# EAGLE design digital lockin (EAGLE 9.6.2)

## Sheet 1 of 2
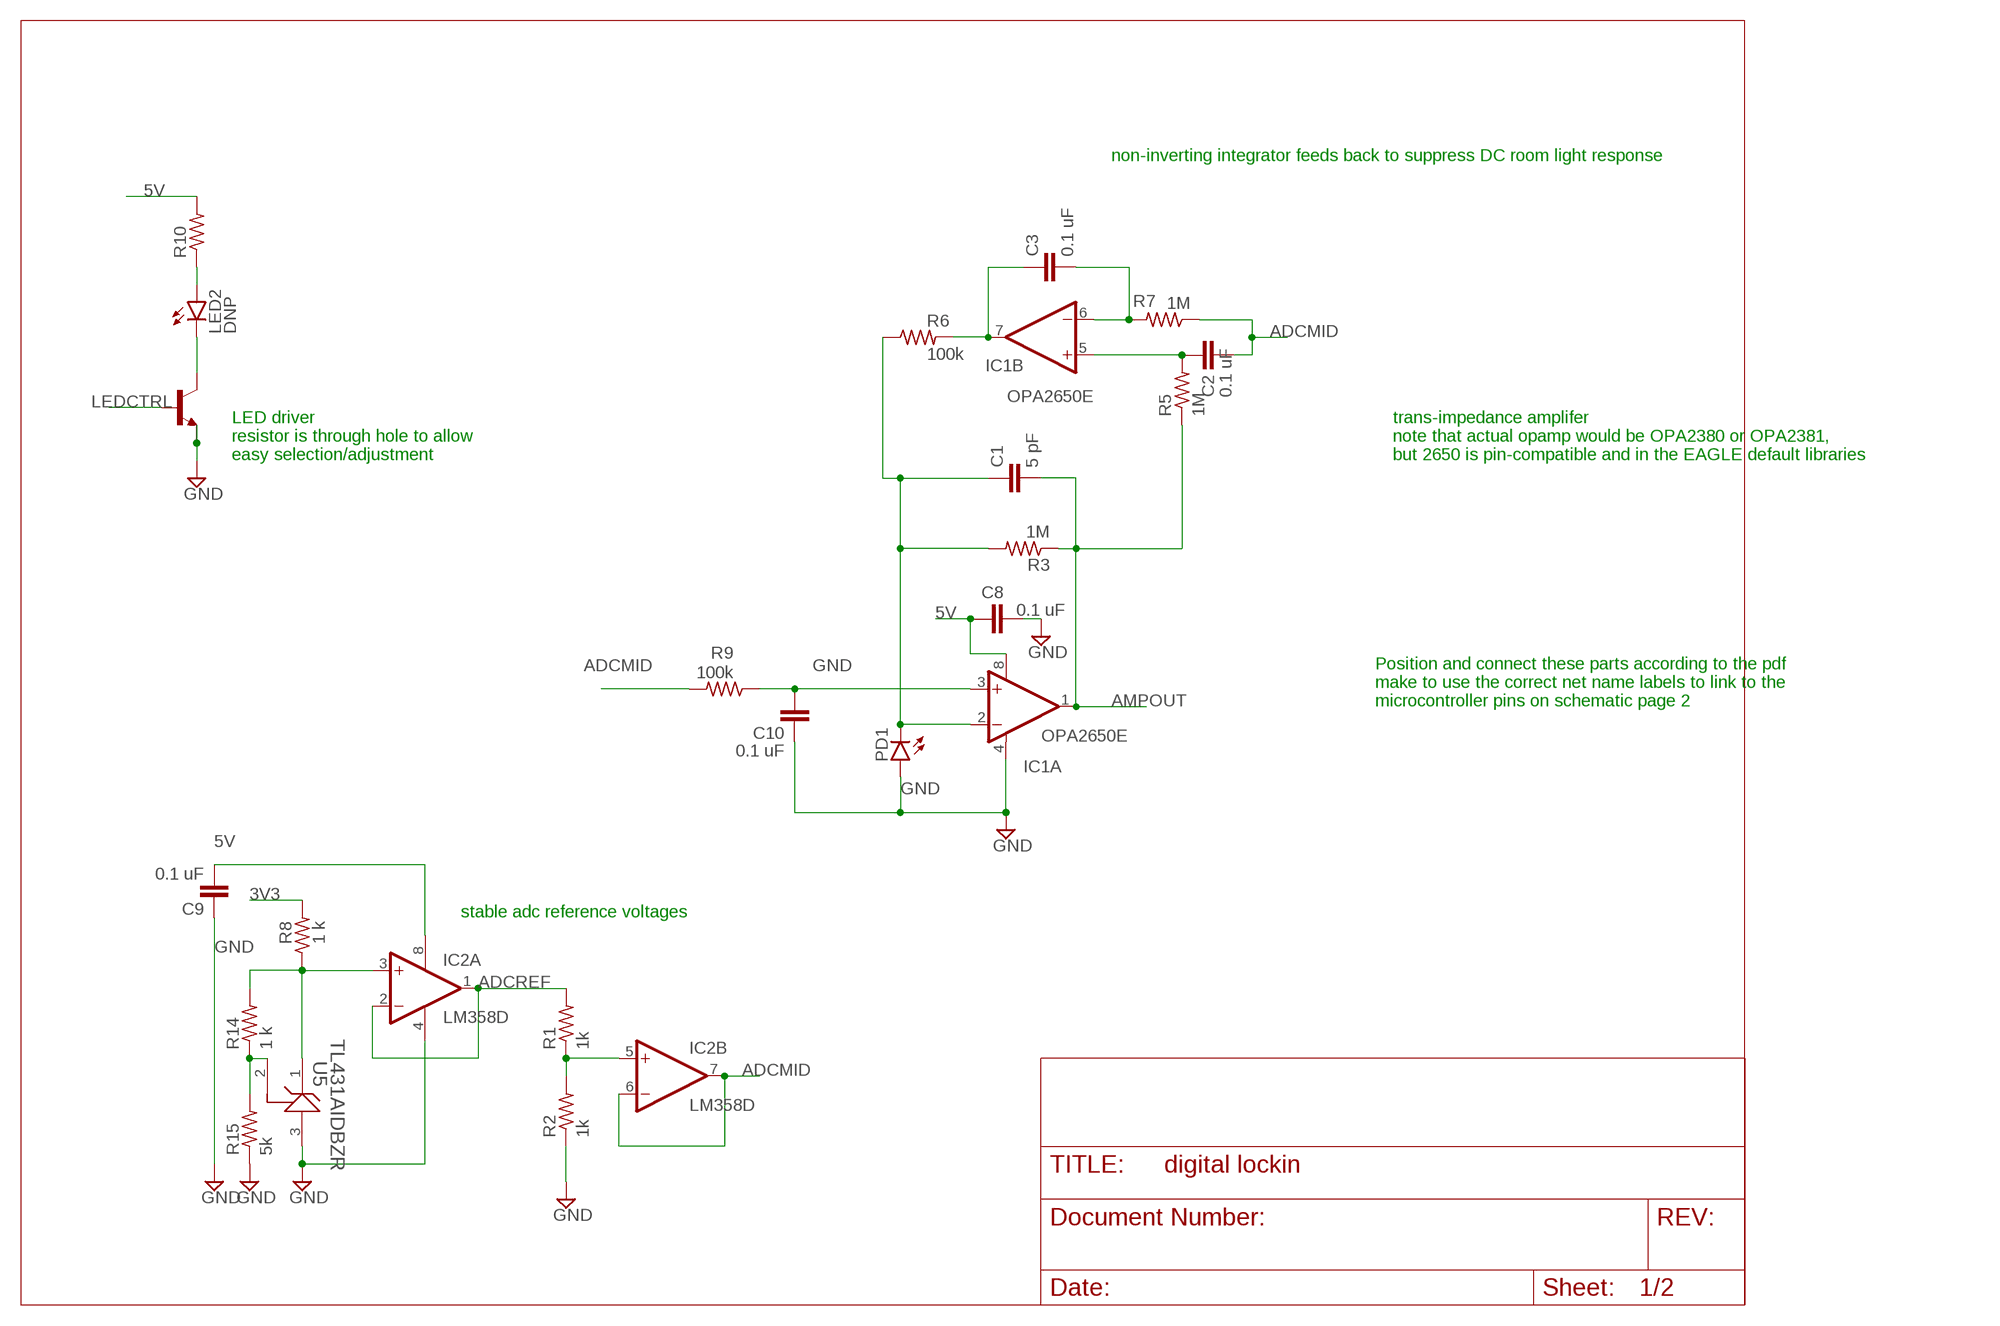
[diagram p0: schematic, sheet 1]

### Parts
C1  5 pF  C-EUC0805  [C0805]
C2  0.1 uF  C-EUC0805  [C0805]
C3  0.1 uF  C-EUC0805  [C0805]
C8  0.1 uF  C-EUC0805  [C0805]
C9  0.1 uF  C-EUC0805  [C0805]
C10  0.1 uF  C-EUC0805  [C0805]
IC1  OPA2650E  [MSOP08]
IC2  LM358D  [SO08]
LED2  DNP  LED5MM  [LED5MM]
PD1  DNP  LED5MM  [LED5MM]
R1  1k  R-US_R0805  [R0805]
R2  1k  R-US_R0805  [R0805]
R3  1M  R-US_R0805  [R0805]
R5  1M  R-US_R0805  [R0805]
R6  100k  R-US_R0805  [R0805]
R7  1M  R-US_R0805  [R0805]
R8  1 k  R-US_R0805  [R0805]
R9  100k  R-US_R0805  [R0805]
R10  DNP  R-US_0204/2V  [0204V]
R14  1 k  R-US_R0805  [R0805]
R15  5k  R-US_R0805  [R0805]
T2  NPN  BC808-NPN-SOT23-BEC  [SOT23-BEC]
U5  TL431AIDBZR  [DBZ0003A_N]

### Nets
3V3 [power]: R8.2 ; also sheet 2
5V [power]: C8.1 C9.2 IC1.8(A:V+) IC2.8(P:V+) R10.2 ; also sheet 2
ADCMID: C2.2 IC2.6(B:-IN) IC2.7(B:OUT) R7.1 R9.2 ; also sheet 2
ADCREF: IC2.1(A:OUT) IC2.2(A:-IN) R1.2 ; also sheet 2
AMPOUT: C1.2 IC1.1(A:OUT) R3.1 R5.1 ; also sheet 2
GND [power]: C8.2 C9.1 C10.1 C10.2 IC1.3(A:+IN) IC1.4(A:V-) IC2.4(P:V-) PD1.A R2.1 R9.1 R15.1 T2.E U5.3(ANODE) ; also sheet 2
LEDCTRL: T2.B ; also sheet 2
N$1: C3.1 IC1.7(B:OUT) R6.2
N$2: C3.2 IC1.6(B:-IN) R7.2
N$3: LED2.K(C) T2.C
N$5: C2.1 IC1.5(B:+IN) R5.2
N$9: IC2.3(A:+IN) R8.1 R14.2 U5.1(CATHODE)
N$10: IC2.5(B:+IN) R1.1 R2.2
N$11: C1.1 IC1.2(A:-IN) PD1.K(C) R3.2 R6.1
N$12: LED2.A R10.1
N$20: R14.1 R15.2 U5.2(REF)

### Notes on the sheet
- non-inverting integrator feeds back to suppress DC room light response
- LED driver
  resistor is through hole to allow 
  easy selection/adjustment
- trans-impedance amplifer
  note that actual opamp would be OPA2380 or OPA2381, 
  but 2650 is pin-compatible and in the EAGLE default libraries
- Position and connect these parts according to the pdf
  make to use the correct net name labels to link to the 
  microcontroller pins on schematic page 2
- stable adc reference voltages

## Sheet 2 of 2
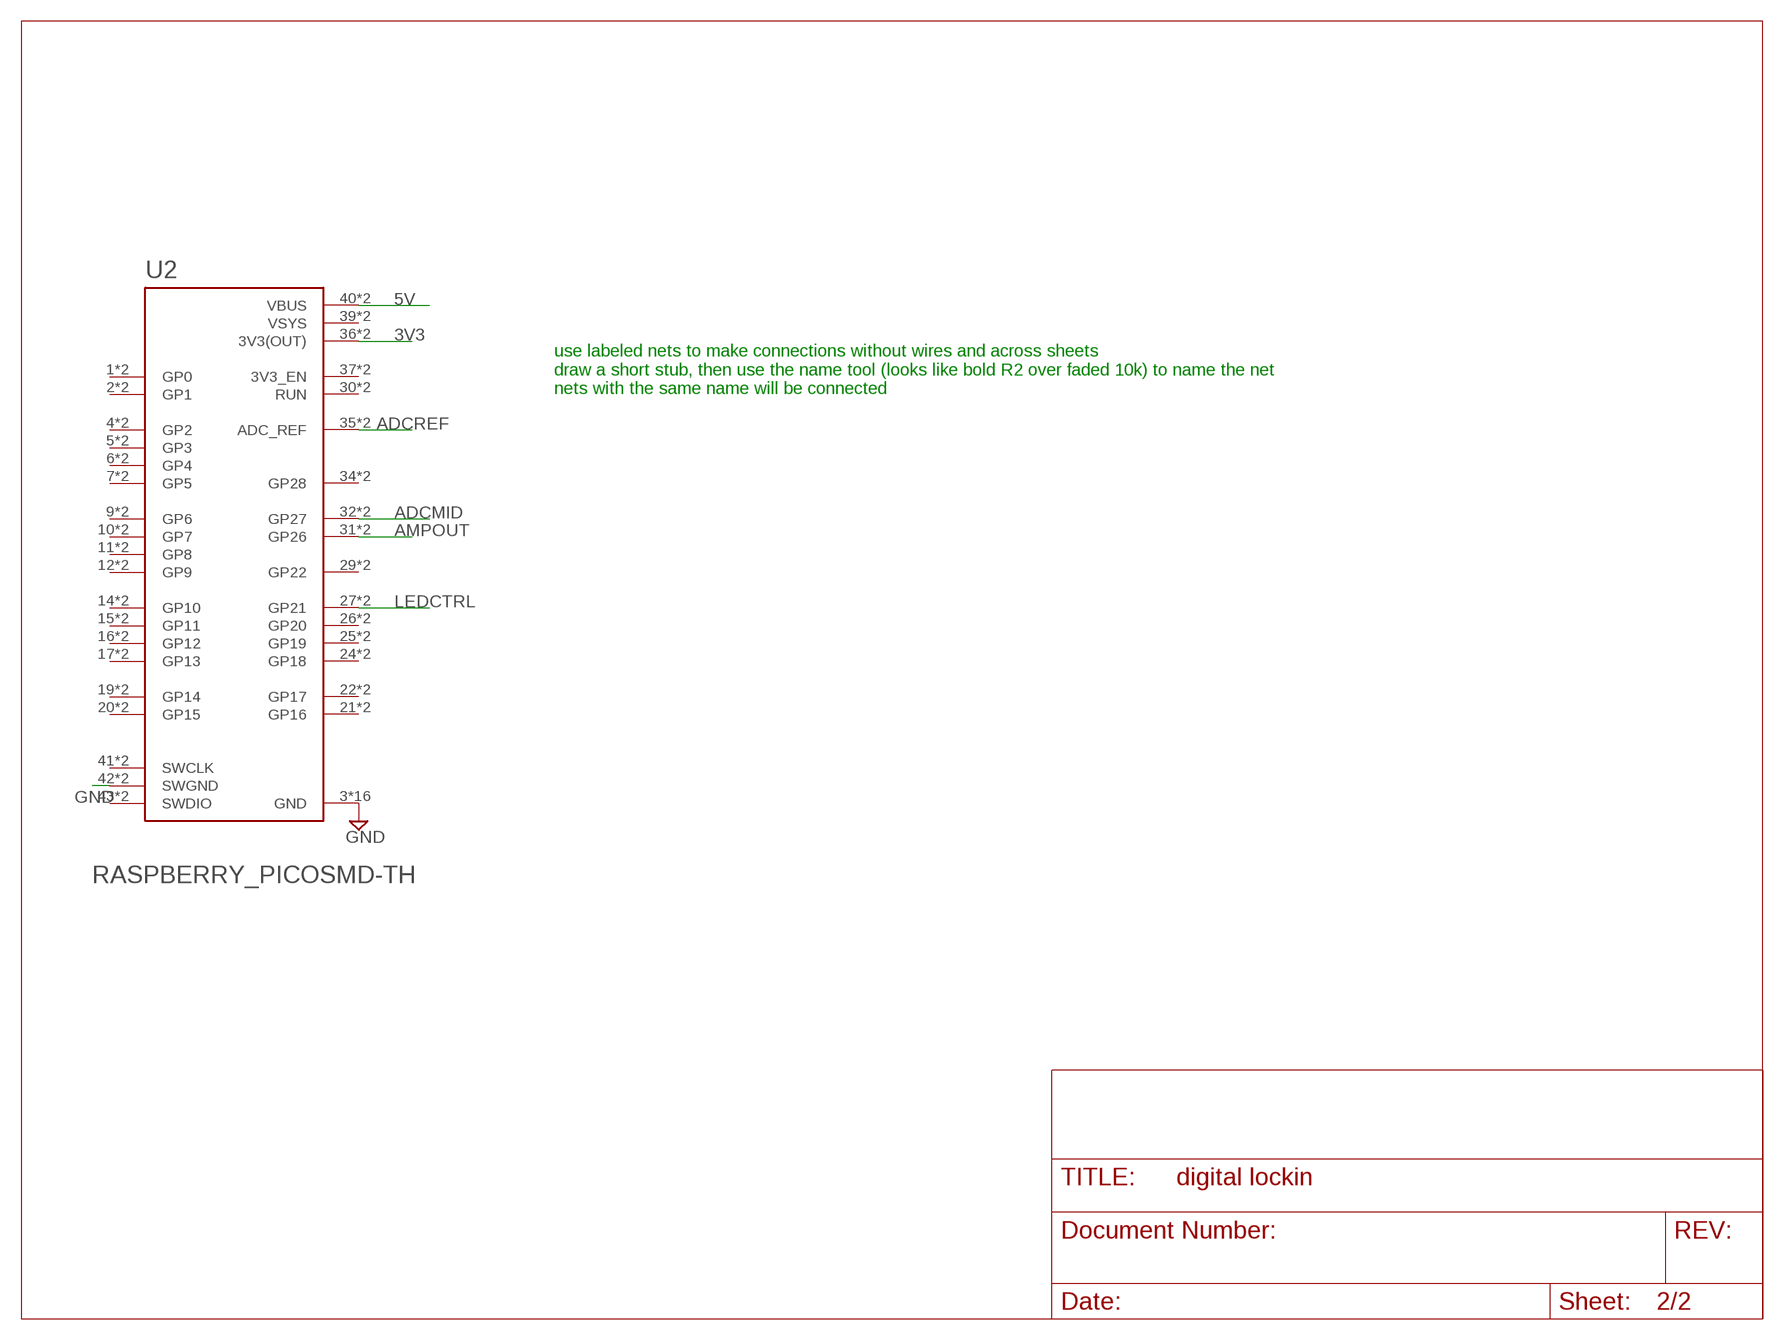
[diagram p1: schematic, sheet 2]

### Parts
U2  RASPBERRY_PICOSMD-TH  [PICO-PKG]

### Nets
3V3 [power]: U2.36(3V3(OUT)) U2.P$36(3V3(OUT)) ; also sheet 1
5V [power]: U2.40(VBUS) U2.P$40(VBUS) ; also sheet 1
ADCMID: U2.32(GP27) U2.P$32(GP27) ; also sheet 1
ADCREF: U2.35(ADC_REF) U2.P$35(ADC_REF) ; also sheet 1
AMPOUT: U2.31(GP26) U2.P$31(GP26) ; also sheet 1
GND [power]: U2.3(GND) U2.8(GND) U2.13(GND) U2.18(GND) U2.23(GND) U2.28(GND) U2.33(GND) U2.38(GND) U2.42(SWGND) U2.P$3(GND) U2.P$8(GND) U2.P$13(GND) U2.P$18(GND) U2.P$23(GND) U2.P$28(GND) U2.P$33(GND) U2.P$38(GND) U2.P$42(SWGND) ; also sheet 1
LEDCTRL: U2.27(GP21) U2.P$27(GP21) ; also sheet 1
Unconnected: U2.1(GP0) U2.2(GP1) U2.4(GP2) U2.5(GP3) U2.6(GP4) U2.7(GP5) U2.9(GP6) U2.10(GP7) U2.11(GP8) U2.12(GP9) U2.14(GP10) U2.15(GP11) U2.16(GP12) U2.17(GP13) U2.19(GP14) U2.20(GP15) U2.21(GP16) U2.22(GP17) U2.24(GP18) U2.25(GP19) U2.26(GP20) U2.29(GP22) U2.30(RUN) U2.34(GP28) U2.37(3V3_EN) U2.41(SWCLK) U2.43(SWDIO) U2.P$1(GP0) U2.P$2(GP1) U2.P$4(GP2) U2.P$5(GP3) U2.P$6(GP4) U2.P$7(GP5) U2.P$9(GP6) U2.P$10(GP7) U2.P$11(GP8) U2.P$12(GP9) U2.P$14(GP10) U2.P$15(GP11) U2.P$16(GP12) U2.P$17(GP13) U2.P$19(GP14) U2.P$20(GP15) U2.P$21(GP16) U2.P$22(GP17) U2.P$24(GP18) U2.P$25(GP19) U2.P$26(GP20) U2.P$29(GP22) U2.P$30(RUN) U2.P$34(GP28) U2.P$37(3V3_EN) U2.P$41(SWCLK) U2.P$43(SWDIO)

### Notes on the sheet
- use labeled nets to make connections without wires and across sheets
  draw a short stub, then use the name tool (looks like bold R2 over faded 10k) to name the net
  nets with the same name will be connected

## Power pins joined to a net without a drawn wire
VSYS: U2.39(VSYS) U2.P$39(VSYS)

## Library data of the parts
C1 = rcl:C-EU: CAPACITOR, European symbol; SPICEPREFIX: C
C2 C3 C8-C10 = rcl:C-EU: CAPACITOR, European symbol; LCSC_PART#: C28233; SPICEPREFIX: C
IC1 = burr-brown:OPA2650: Dual Wideband, Low Power Voltage Feedback Operational Amplifier; ACTUAL_PART: OPA2381; LCSC_PART#: C181662; OC_FARNELL: unknown; OC_NEWARK: unknown
IC2 = linear:LM358: OP AMP also LM158; LM258; LM2904 Source: http://cache.national.com/ds/LM/LM158.pdf; LCSC_PART#: C7950
LED2 PD1 = led:LED: LED OSRAM: - CHIPLED LG R971, LG N971, LY N971, LG Q971, LY Q971, LO R971, LY R971 LH N974, LH R974 LS Q976, LO Q976, LY Q976 LO Q996 - Hyper CHIPLED LW Q18S LB Q993, LB Q99A, LB R99A - SideLED LS A670, LO A670, LY A670, LG A670, LP A670 LB A673, LV A673, LT A673, LW A673 LH A674 LY A675 LS A676, LA A676, LO A676, LY A676, LW A676 LS A679, LY A679, LG A679 - Hyper Micro SIDELED® LS Y876, LA Y876, LO Y876, LY Y876 LT Y87S - SmartLED LW L88C, LW L88S LB L89C, LB L89S, LG L890 LS L89K, LO L89K, LY L89K LS L896, LA L896, LO L896, LY L896 - TOPLED LS T670, LO T670, LY T670, LG T670, LP T670 LSG T670, LSP T670, LSY T670, LOP T670, LYG T670 LG T671, LOG T671, LSG T671 LB T673, LV T673, LT T673, LW T673 LH T674 LS T676, LA T676, LO T676, LY T676, LB T676, LH T676, LSB T676, LW T676 LB T67C, LV T67C, LT T67C, LS T67K, LO T67K, LY T67K, LW E67C LS E67B, LA E67B, LO E67B, LY E67B, LB E67C, LV E67C, LT E67C LW T67C LS T679, LY T679, LG T679 LS T770, LO T770, LY T770, LG T770, LP T770 LB T773, LV T773, LT T773, LW T773 LH T774 LS E675, LA E675, LY E675, LS T675 LS T776, LA T776, LO T776, LY T776, LB T776 LHGB T686 LT T68C, LB T68C - Hyper Mini TOPLED® LB M676 - Mini TOPLED Santana® LG M470 LS M47K, LO M47K, LY M47K Source: http://www.osram.convergy.de LUXEON: - LUMILED® LXK2-PW12-R00, LXK2-PW12-S00, LXK2-PW14-U00, LXK2-PW14-V00 LXK2-PM12-R00, LXK2-PM12-S00, LXK2-PM14-U00 LXK2-PE12-Q00, LXK2-PE12-R00, LXK2-PE12-S00, LXK2-PE14-T00, LXK2-PE14-U00 LXK2-PB12-K00, LXK2-PB12-L00, LXK2-PB12-M00, LXK2-PB14-N00, LXK2-PB14-P00, LXK2-PB14-Q00 LXK2-PR12-L00, LXK2-PR12-M00, LXK2-PR14-Q00, LXK2-PR14-R00 LXK2-PD12-Q00, LXK2-PD12-R00, LXK2-PD12-S00 LXK2-PH12-R00, LXK2-PH12-S00 LXK2-PL12-P00, LXK2-PL12-Q00, LXK2-PL12-R00 Source: www.luxeon.com KINGBRIGHT: KA-3528ASYC Source: www.kingbright.com
R1 R2 R8 R14 = rcl:R-US_: RESISTOR, American symbol; LCSC_PART#: C17513; SPICEPREFIX: R
R3 R5 R7 = rcl:R-US_: RESISTOR, American symbol; LCSC_PART#: C17514; SPICEPREFIX: R
R6 R9 = rcl:R-US_: RESISTOR, American symbol; LCSC_PART#: C149504; SPICEPREFIX: R
R10 R15 = rcl:R-US_: RESISTOR, American symbol; SPICEPREFIX: R
T2 = transistor:*-NPN-: NPN Transistror BF959 corrected 2008.03.06; LCSC_PART#: C2145
U2 = RpiPico:RASPBERRY_PICO: Raspberry Pi Pico
U5 = tl431:TL431AIDBZR; COPYRIGHT: Copyright (C) 2025 Ultra Librarian. All rights reserved.; LCSC_PART#: C3113; MANUFACTURER_PART_NUMBER: TL431AIDBZR; MFR_NAME: Texas Instruments; REFDES: RefDes; TYPE: TYPE

## Net classes
1 power: width 0.305 mm

## Board
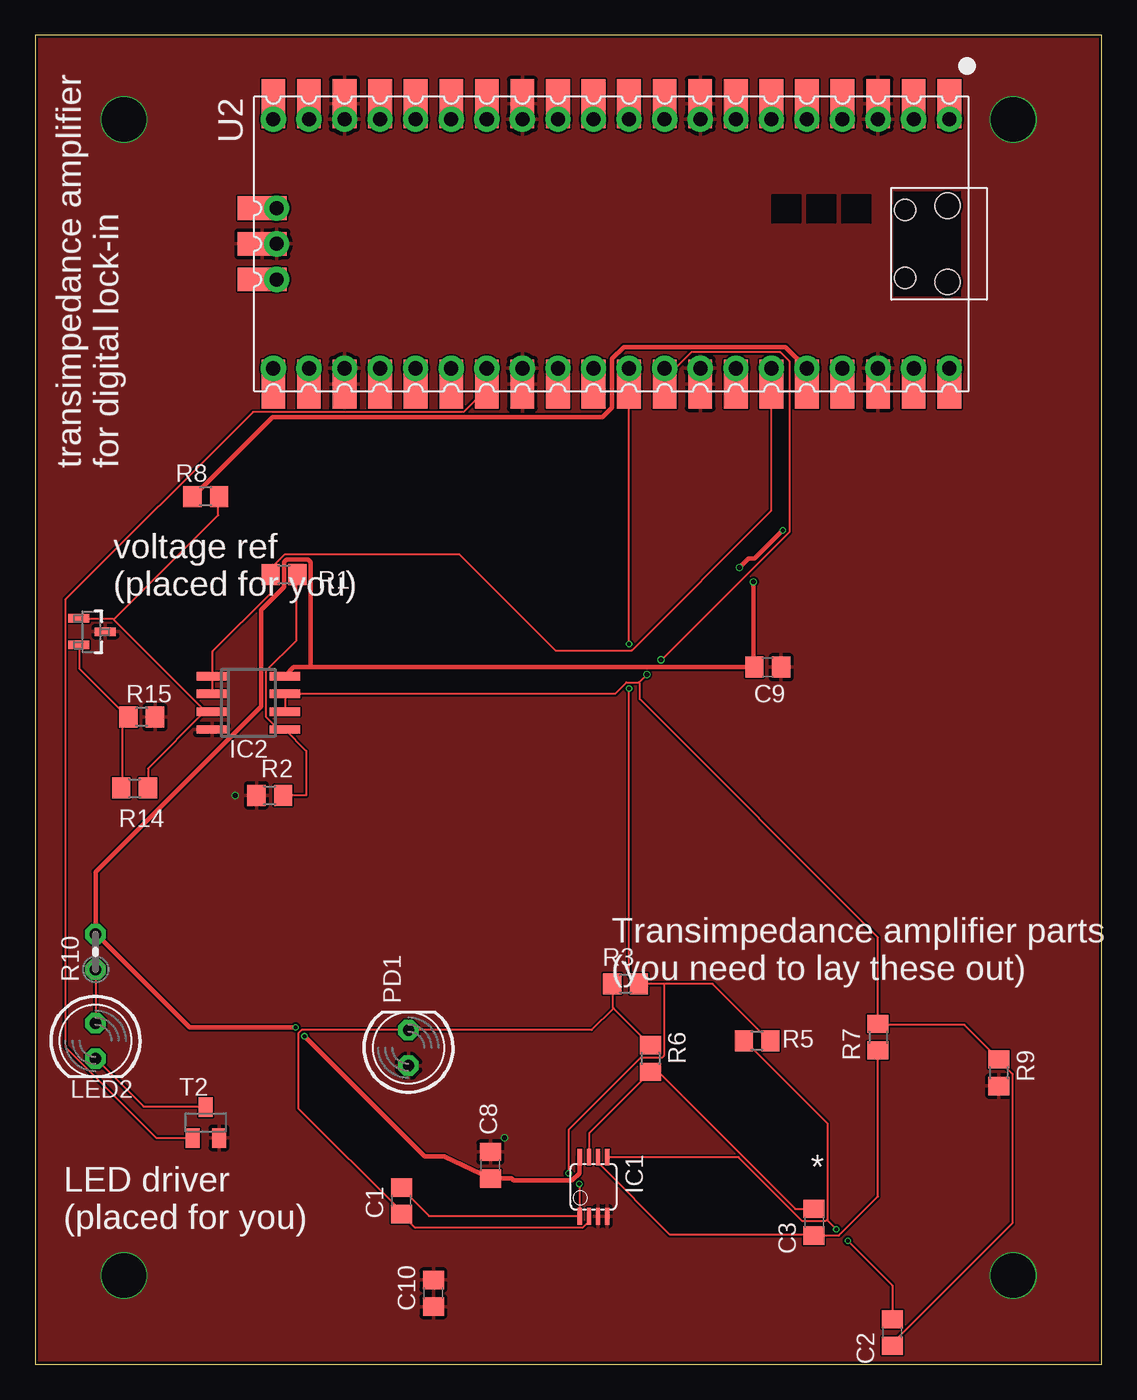
[diagram p2: board, top side]
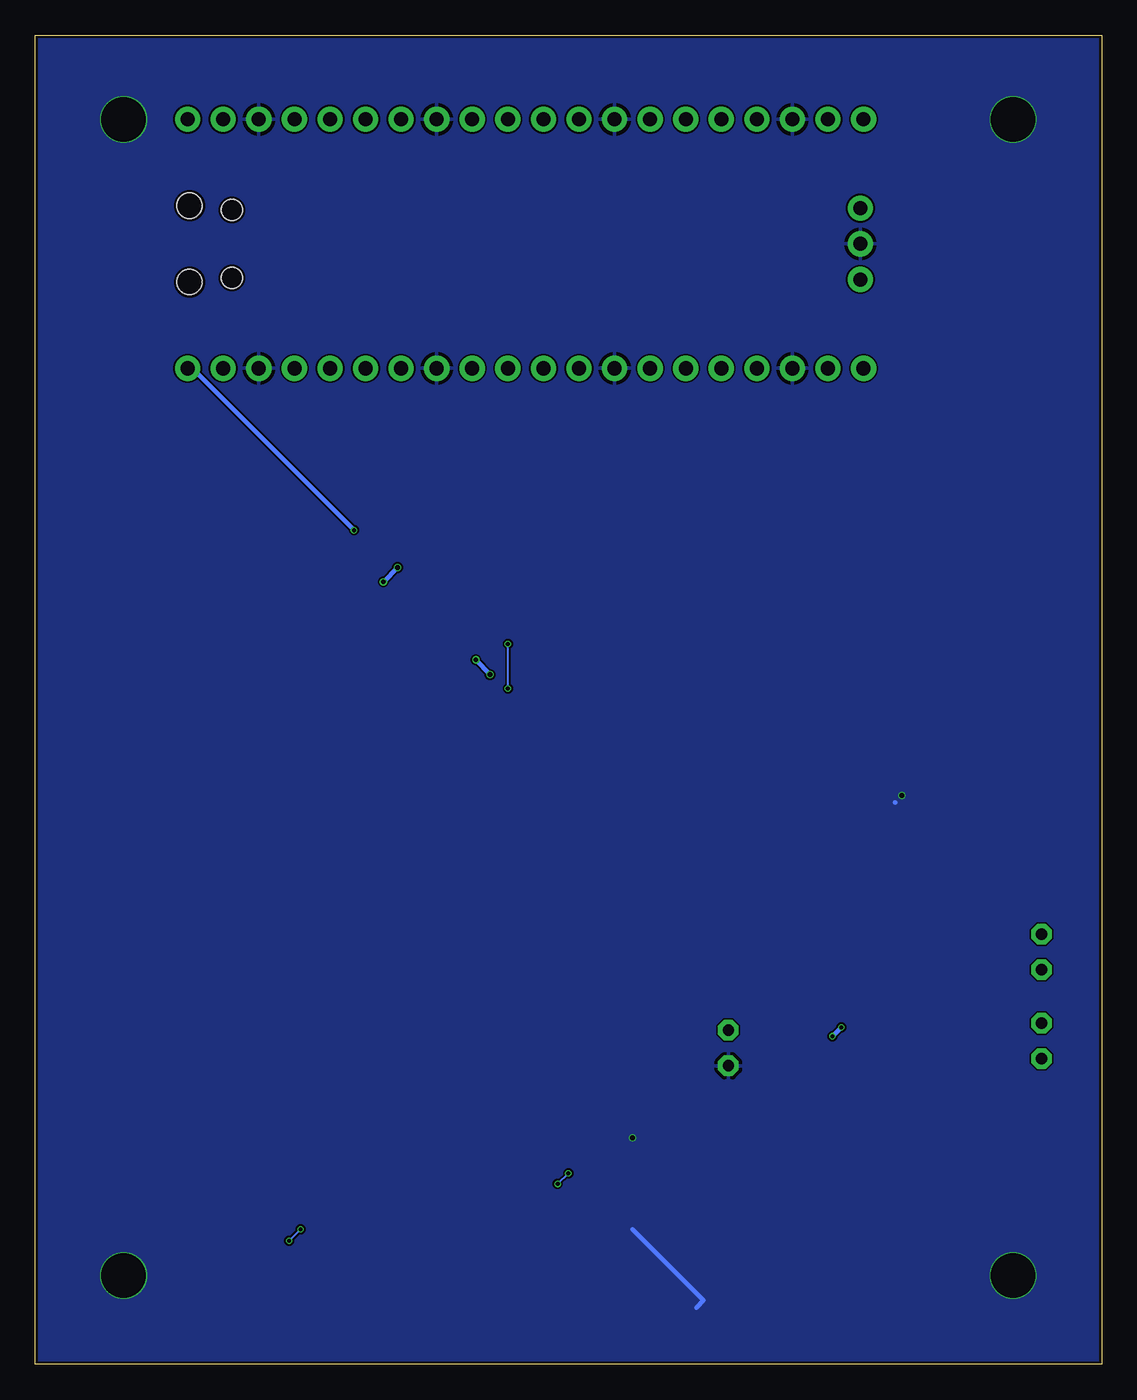
[diagram p3: board, bottom side, seen from below]

Size 76.18 x 94.92 mm. Coordinates in mm from the lower left corner, seen from the top.
Outline: 0,0 76.18,0 76.18,94.92 0,94.92 0,0
Copper layers (1*16): Top 0.035mm / dielectric 1.6mm / Bottom 0.035mm
Design rules "jlcpcb-2layers": minimum track width 5mil, minimum drill 0.3mm, track to track 5mil, track to pad 5mil, pad to pad 5mil, via to via 5mil, smd to smd 5mil, copper to edge 0.2mm, drill to drill 6mil, minimum pad ring 10mil, minimum via ring 3mil, stop-mask expansion 4mil, vias tented up to drill 0mil, thermal gap 10mil

### Footprints (pad centres in the part's own frame; a part is rotated, then mirrored left to right if it is on the bottom)
C0805 = smd 1.3 x 1.5: 1 -0.95,0; 2 0.95,0
MSOP08 = smd 0.3 x 1.2: 1 -0.976,-2.113; 2 -0.326,-2.113; 3 0.324,-2.113; 4 0.974,-2.113; 5 0.974,2.112; 6 0.324,2.112; 7 -0.326,2.112; 8 -0.976,2.112
SO08 = smd 0.6 x 2.2: 1 -1.905,-2.6; 2 -0.635,-2.6; 3 0.635,-2.6; 4 1.905,-2.6; 5 1.905,2.6; 6 0.635,2.6; 7 -0.635,2.6; 8 -1.905,2.6
LED5MM = drill 0.813 octagon: A -1.27,0; K 1.27,0
R0805 = smd 1.3 x 1.5: 1 -0.95,0; 2 0.95,0
0204V = drill 0.813 octagon: 1 -1.27,0; 2 1.27,0
SOT23-BEC = smd 1 x 1.4: B -0.95,-1.1; C 0,1.1; E 0.95,-1.1
PICO-PKG = drill 1: 1 -8.89,24.13; 2 -8.89,21.59; 3 -8.89,19.05; 4 -8.89,16.51; 5 -8.89,13.97; 6 -8.89,11.43; 7 -8.89,8.89; 8 -8.89,6.35; 9 -8.89,3.81; 10 -8.89,1.27; 11 -8.89,-1.27; 12 -8.89,-3.81; 13 -8.89,-6.35; 14 -8.89,-8.89; 15 -8.89,-11.43; 16 -8.89,-13.97; 17 -8.89,-16.51; 18 -8.89,-19.05; 19 -8.89,-21.59; 20 -8.89,-24.13; 21 8.89,-24.13; 22 8.89,-21.59; 23 8.89,-19.05; 24 8.89,-16.51; 25 8.89,-13.97; 26 8.89,-11.43; 27 8.89,-8.89; 28 8.89,-6.35; 29 8.89,-3.81; 30 8.89,-1.27; 31 8.89,1.27; 32 8.89,3.81; 33 8.89,6.35; 34 8.89,8.89; 35 8.89,11.43; 36 8.89,13.97; 37 8.89,16.51; 38 8.89,19.05; 39 8.89,21.59; 40 8.89,24.13; 41 -2.54,-23.9; 42 0,-23.9; 43 2.54,-23.9 | smd 3.5 x 1.7: P$1 -10,24.13; P$2 -10,21.59; P$3 -10,19.05; P$4 -10,16.51; P$5 -10,13.97; P$6 -10,11.43; P$7 -10,8.89; P$8 -10,6.35; P$9 -10,3.81; P$10 -10,1.27; P$11 -10,-1.27; P$12 -10,-3.81; P$13 -10,-6.35; P$14 -10,-8.89; P$15 -10,-11.43; P$16 -10,-13.97; P$17 -10,-16.51; P$18 -10,-19.05; P$19 -10,-21.59; P$20 -10,-24.13; P$21 10,-24.13; P$22 10,-21.59; P$23 10,-19.05; P$24 10,-16.51; P$25 10,-13.97; P$26 10,-11.43; P$27 10,-8.89; P$28 10,-6.35; P$29 10,-3.81; P$30 10,-1.27; P$31 10,1.27; P$32 10,3.81; P$33 10,6.35; P$34 10,8.89; P$35 10,11.43; P$36 10,13.97; P$37 10,16.51; P$38 10,19.05; P$39 10,21.59; P$40 10,24.13 | smd 1.7 x 3.5: P$41 -2.54,-24.925; P$42 0,-24.925; P$43 2.54,-24.925 | hole 1.8: -2.725,24; 2.725,24 | hole 1.5: -2.425,20.97; 2.425,20.97
DBZ0003A_N = smd 1.5 x 0.6: 1 0.95,-0.95; 2 0.95,0.95; 3 -0.95,0

### Placement (x,y rotation side)
C1  26.16,11.68 90 top
C2  61.21,2.29 270 top
C3  55.63,10.16 270 top
C8  32.51,14.22 90 top
C9  52.32,49.78 180 top
C10  28.45,5.08 90 top
IC1  39.88,12.7 0 top
IC2  15.24,47.24 270 top
LED2  4.32,23.11 270 top
PD1  26.67,22.61 90 top
R1  17.78,56.39 180 top
R2  16.76,40.64 0 top
R3  42.16,27.18 180 top
R5  51.56,23.11 180 top
R6  43.94,21.84 270 top
R7  60.2,23.37 270 top
R8  12.19,61.98 180 top
R9  68.83,20.83 90 top
R10  4.32,29.46 90 top
R14  7.11,41.15 0 top
R15  7.62,46.23 180 top
T2  12.19,17.27 0 top
U2  41.15,80.01 270 top
U5  4.06,52.32 180 top

### Tracks (layer width: path | path; a pad name or v marks a point on that pad's centre or on a via)
3V3
  Top 0.305: R8.2 11.3,61.98 16.95,67.63 40.51,67.63 41.21,68.33 41.21,71.82 42.04,72.64 53.59,72.64 U2.36 U2.P$36
5V  (via drill 0.3, 0.35)
  Top 0.305: IC1.8 38.86,14.8 38.86,13.65 38.35,13.14 34.16,13.14 34.03,13.27 C8.1 29.21,14.86 27.81,14.86 v19.24,23.43 | 19.68,49.78 18.48,49.78 IC2.8 | 19.68,49.78 C9.2 51.31,49.85 v51.31,55.88 | 19.68,49.78 19.68,57.28 19.49,57.47 17.97,57.47 17.78,57.28 17.78,55.5 16.13,53.85 16.13,46.99 4.32,35.18 R10.2 4.45,30.67 11.05,24.07 v18.61,24.07 | v53.4,59.56 51.37,57.53 50.93,57.53 v50.29,56.9
  Bottom 0.305: v18.61,24.07 v19.24,23.43 | U2.40 64.96,71.12 v53.4,59.56 | v51.31,55.88 v50.29,56.9
ADCMID  (via drill 0.35)
  Top 0.127: IC2.7 IC2.6 | C2.2 61.21,1.52 69.79,10.1 69.79,20.77 68.83,21.72 R9.2 66.36,24.26 60.2,24.26 R7.1 60.2,30.48 43.18,47.5 43.18,48.64 43.12,48.7 | IC2.7 41.4,47.88 42.23,48.7 43.12,48.7 | IC2.7 | U2.32 45.72,71.12 46.86,72.26 53.21,72.26 53.85,71.63 53.85,59.42 44.74,50.31 v44.7,50.31 | 43.12,48.7 43.69,49.28
  Top 0.305: 43.69,49.28 v43.69,49.25
  Bottom 0.305: v43.69,49.25 43.69,49.28 44.7,50.29 v44.7,50.31
ADCREF
  Top 0.127: IC2.2 IC2.1 12.7,49.15 12.7,50.93 16.83,55.05 R1.2 16.89,56.39 16.89,56.9 17.84,57.85 30.29,57.85 37.15,50.99 42.61,50.99 52.58,60.96 U2.P$35
AMPOUT  (via drill 0.3)
  Top 0.127: C1.2 26.16,12.57 28.13,10.6 38.86,10.6 IC1.1 38.86,10.67 v38.86,12.89 | 44.9,27.18 48.39,27.18 52.45,23.11 R5.1 | 44.9,27.18 R3.1 43.05,27.18 42.42,27.81 v42.42,48.26 | v42.42,51.44 U2.P$31 | v38.1,13.65 38.1,16.76 43.24,21.91 44.77,21.91 44.9,22.04 44.9,27.18
  Bottom 0.127: v42.42,48.26 v42.42,51.44 | v38.1,13.65 v38.86,12.89
GND  (via drill 0.35, 3.17)
  Bottom 0.305: 33.53,9.65 28.45,4.57 28.96,4.06 | 14.73,40.13 14.8,40.13
  other vias: 69.85,6.35 6.35,6.35 6.35,88.9 69.85,88.9 33.53,16.19 14.29,40.64
  pour Top: 0.51,95.5 75.69,95.5 77.22,93.98 77.22,1.02 75.18,-1.02 1.02,-1.02 -0.51,0.51 -0.51,94.49
  pour Top: 0.51,95.5 75.69,95.5 77.22,93.98 77.22,1.02 75.18,-1.02 1.02,-1.02 -0.51,0.51 -0.51,94.49
  pour Bottom: 0.51,95.5 75.69,95.5 77.22,93.98 77.22,1.02 76.71,0.51 75.18,-1.02 1.52,-1.02 1.02,-1.02 -0.51,0.51 -0.51,94.49
LEDCTRL
  Top 0.127: U2.P$27 32.26,69.66 30.61,68.01 15.56,68.01 2.16,54.61 2.16,22.67 8.64,16.19 11.24,16.19 T2.B
N$1
  Top 0.127: IC1.7 39.56,14.86 39.56,16.51 R6.2 43.94,20.83 44.58,20.83 54.29,11.11 C3.1
N$2
  Top 0.127: IC1.6 40.26,14.8 40.26,14.35 45.34,9.27 55.63,9.27 C3.2 57.4,9.21 60.2,12 R7.2
N$3
  Top 0.127: LED2.K 7.75,18.41 12.19,18.41 T2.C
N$5  (via drill 0.3)
  Top 0.127: 56.55,10.32 56.58,10.35 56.58,17.21 50.67,23.11 R5.2 | 56.55,10.32 56.45,10.22 54.8,10.22 50.23,14.8 40.89,14.8 IC1.5 | C2.1 61.21,5.65 v58.04,8.83 | 56.55,10.32 v57.21,9.65
  Bottom 0.127: v57.21,9.65 v58.04,8.83
N$9
  Top 0.127: 5.62,53.18 12.19,46.61 IC2.3 12.13,46.61 8.06,42.55 R14.2 | 5.62,53.18 5.59,53.21 3.17,53.21 U5.1 | 5.62,53.18 13.08,60.64 13.08,61.98 R8.1
N$10
  Top 0.127: R1.1 18.67,56.39 18.67,51.69 16.51,49.53 16.51,46.23 17.4,45.34 IC2.5 19.37,43.81 19.37,40.64 R2.2
N$11
  Top 0.127: IC1.2 39.5,10.54 39.5,10.16 39.12,9.78 27.11,9.78 C1.1 26.16,10.92 18.8,18.29 18.8,23.62 19.05,23.88 PD1.K 39.75,23.88 41.31,25.43 | 41.31,25.43 R6.1 | 41.31,25.43 41.27,25.46 41.27,27.18 R3.2
N$12
  Top 0.127: R10.1 LED2.A
N$20
  Top 0.127: R14.1 6.22,41.15 6.22,45.78 R15.2 6.6,46.23 3.17,49.66 3.17,51.37 U5.2

### Text on the board
tPlace: TIPS: / turn off the ground airwires / command: ratsnest ! GND / "untangle" the remaining airwires as best you can / (see voltage ref for an example) / pour a ground plane on both sides / (use polygon on top layer(1) and then polygon on bottom layer (16) , type GND for the net name) / then use ripup/visible polygons so you can see what you're doing again / Tools->Autorouter will attempt to route the board automatically / If you do by hand, make one layer horizontal (e.g. top) wires / and one layer (e.g. bottom) vertical wires. / Use the middle mouse button to switch layers while drawing and insert a via automatically / At power supply GND and bypass capacitor grounds, try to make a short stub and then add a via (middle mouse button) / then hit esc to end on the via / this will make a connection to the ground plane on both sides of the board / After you autoroute, type ratsnest to fill the polygons and run a DRC to check for airwires. / Usually these are on the ground plane. / Add vias to ground (see above) where needed and on power supply pins/bypass caps | voltage ref / (placed for you) | Transimpedance amplifier parts / (you need to lay these out) | LED driver / (placed for you) | I have already done this, but to make the autorouter draw thick power wires (so they can carry current), use edit->net classes / to set the power nets and then rules to say a minimum width (here 12)
tNames: transimpedance amplifier / for digital lock-in | *